# EAGLE schematic A20-OLINUXINO-MICRO_Rev_J1 (EAGLE 4.16), part 1 of 2
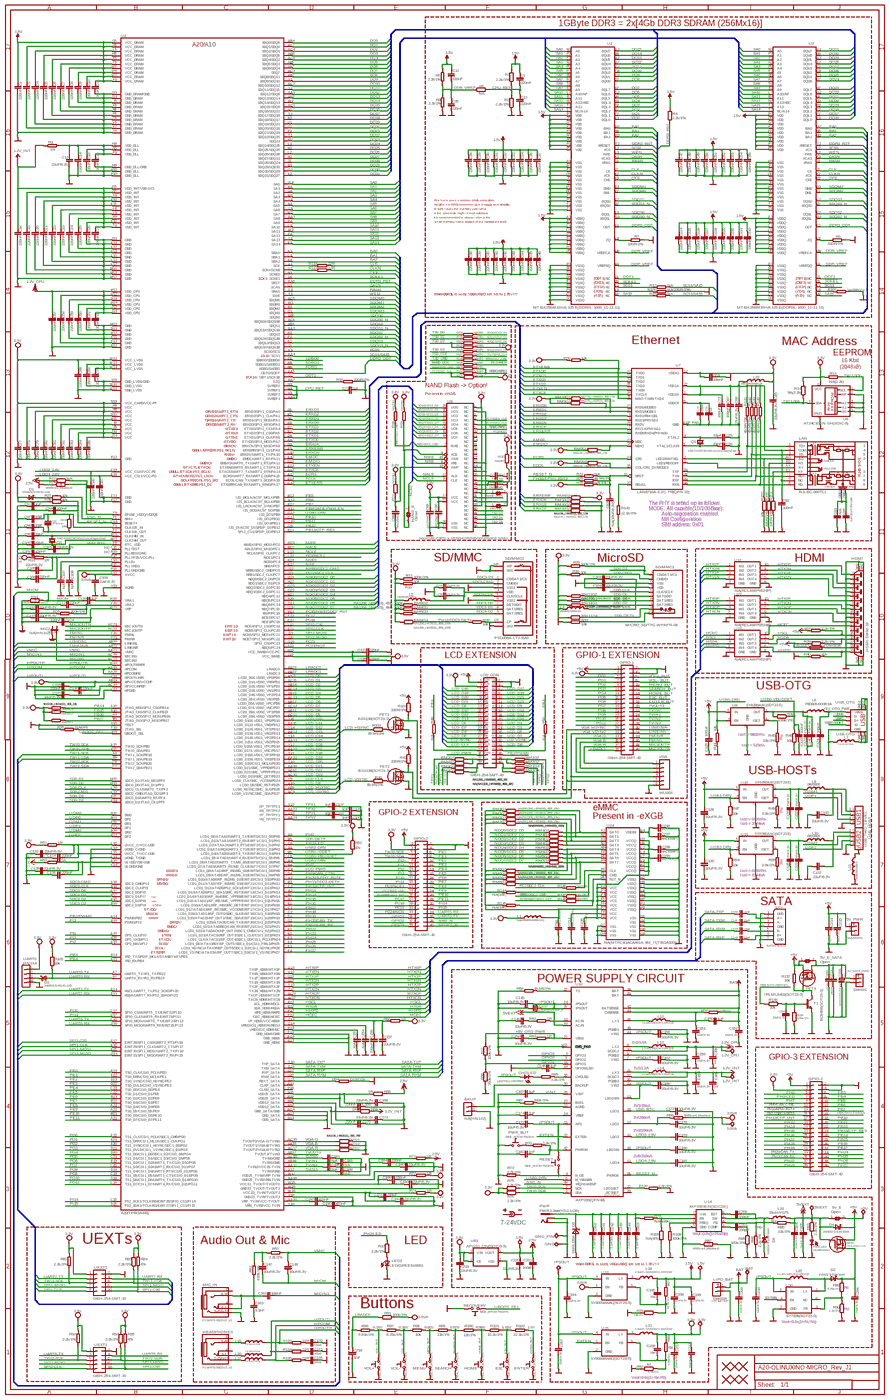
[diagram p0: schematic, sheet 1, overview]
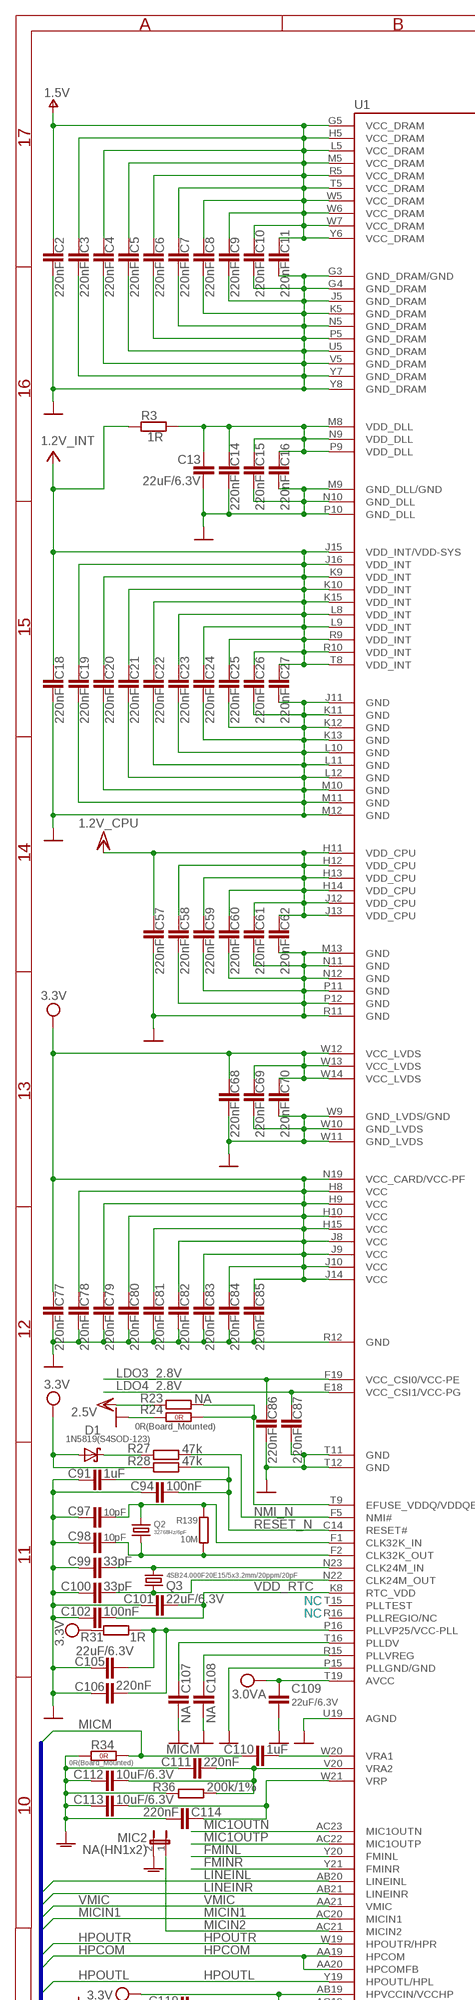
[diagram p1: schematic, sheet 1, part 1 of 4]
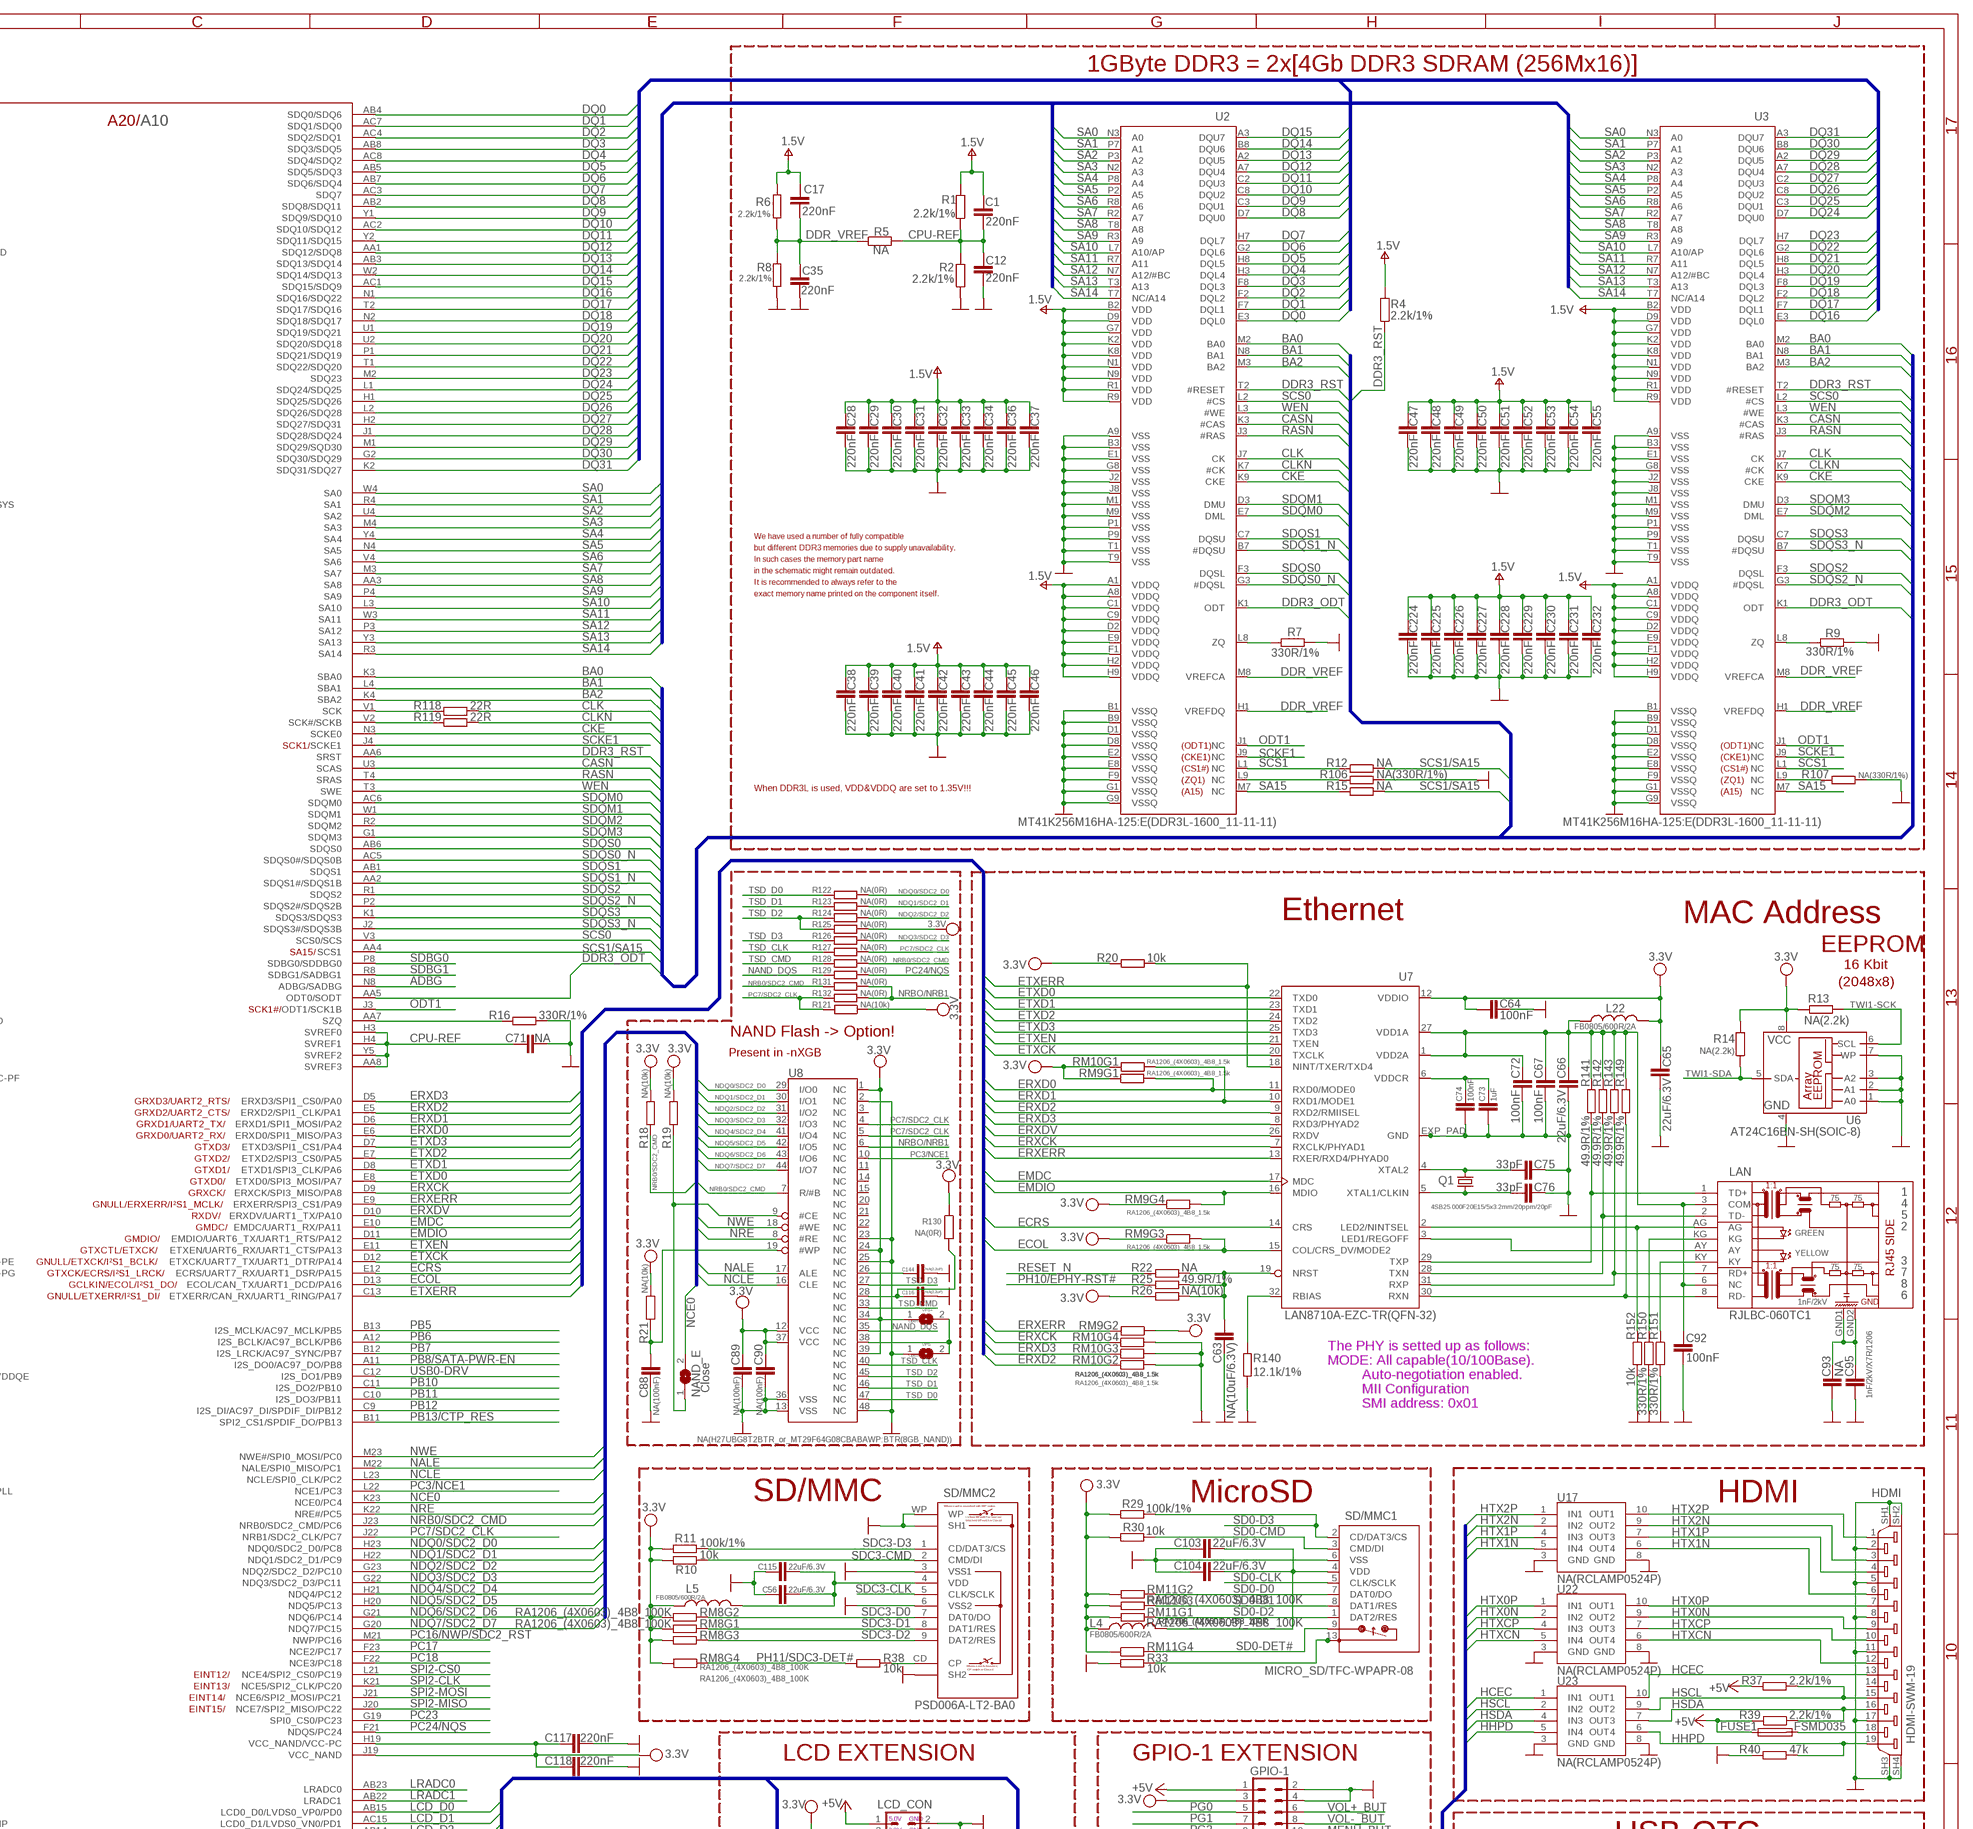
[diagram p2: schematic, sheet 1, part 2 of 4]
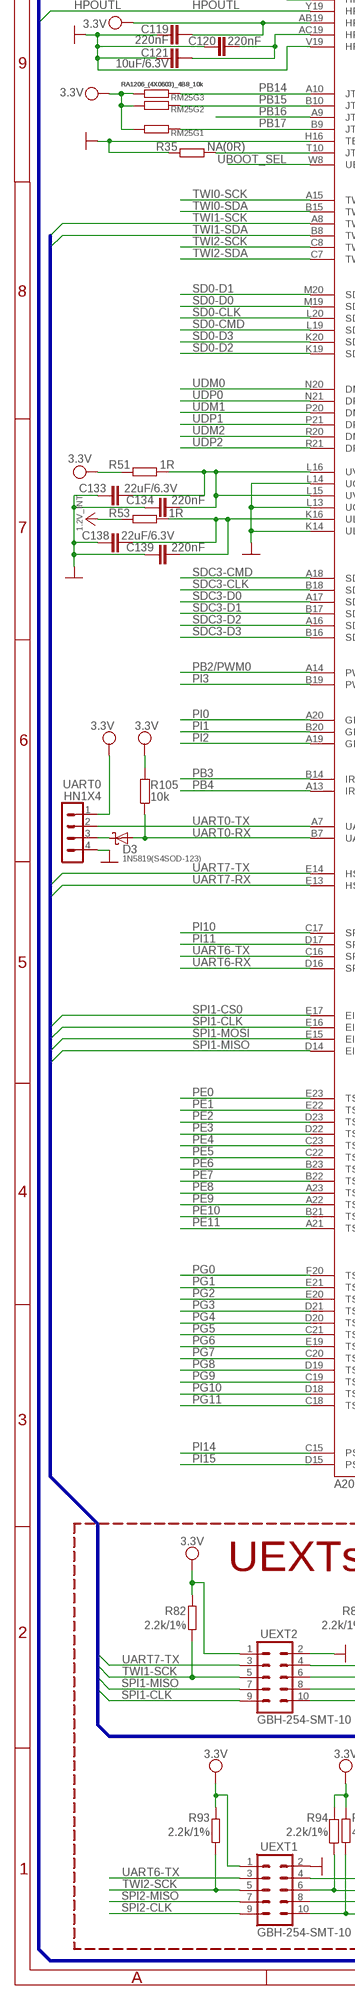
[diagram p3: schematic, sheet 1, part 3 of 4]
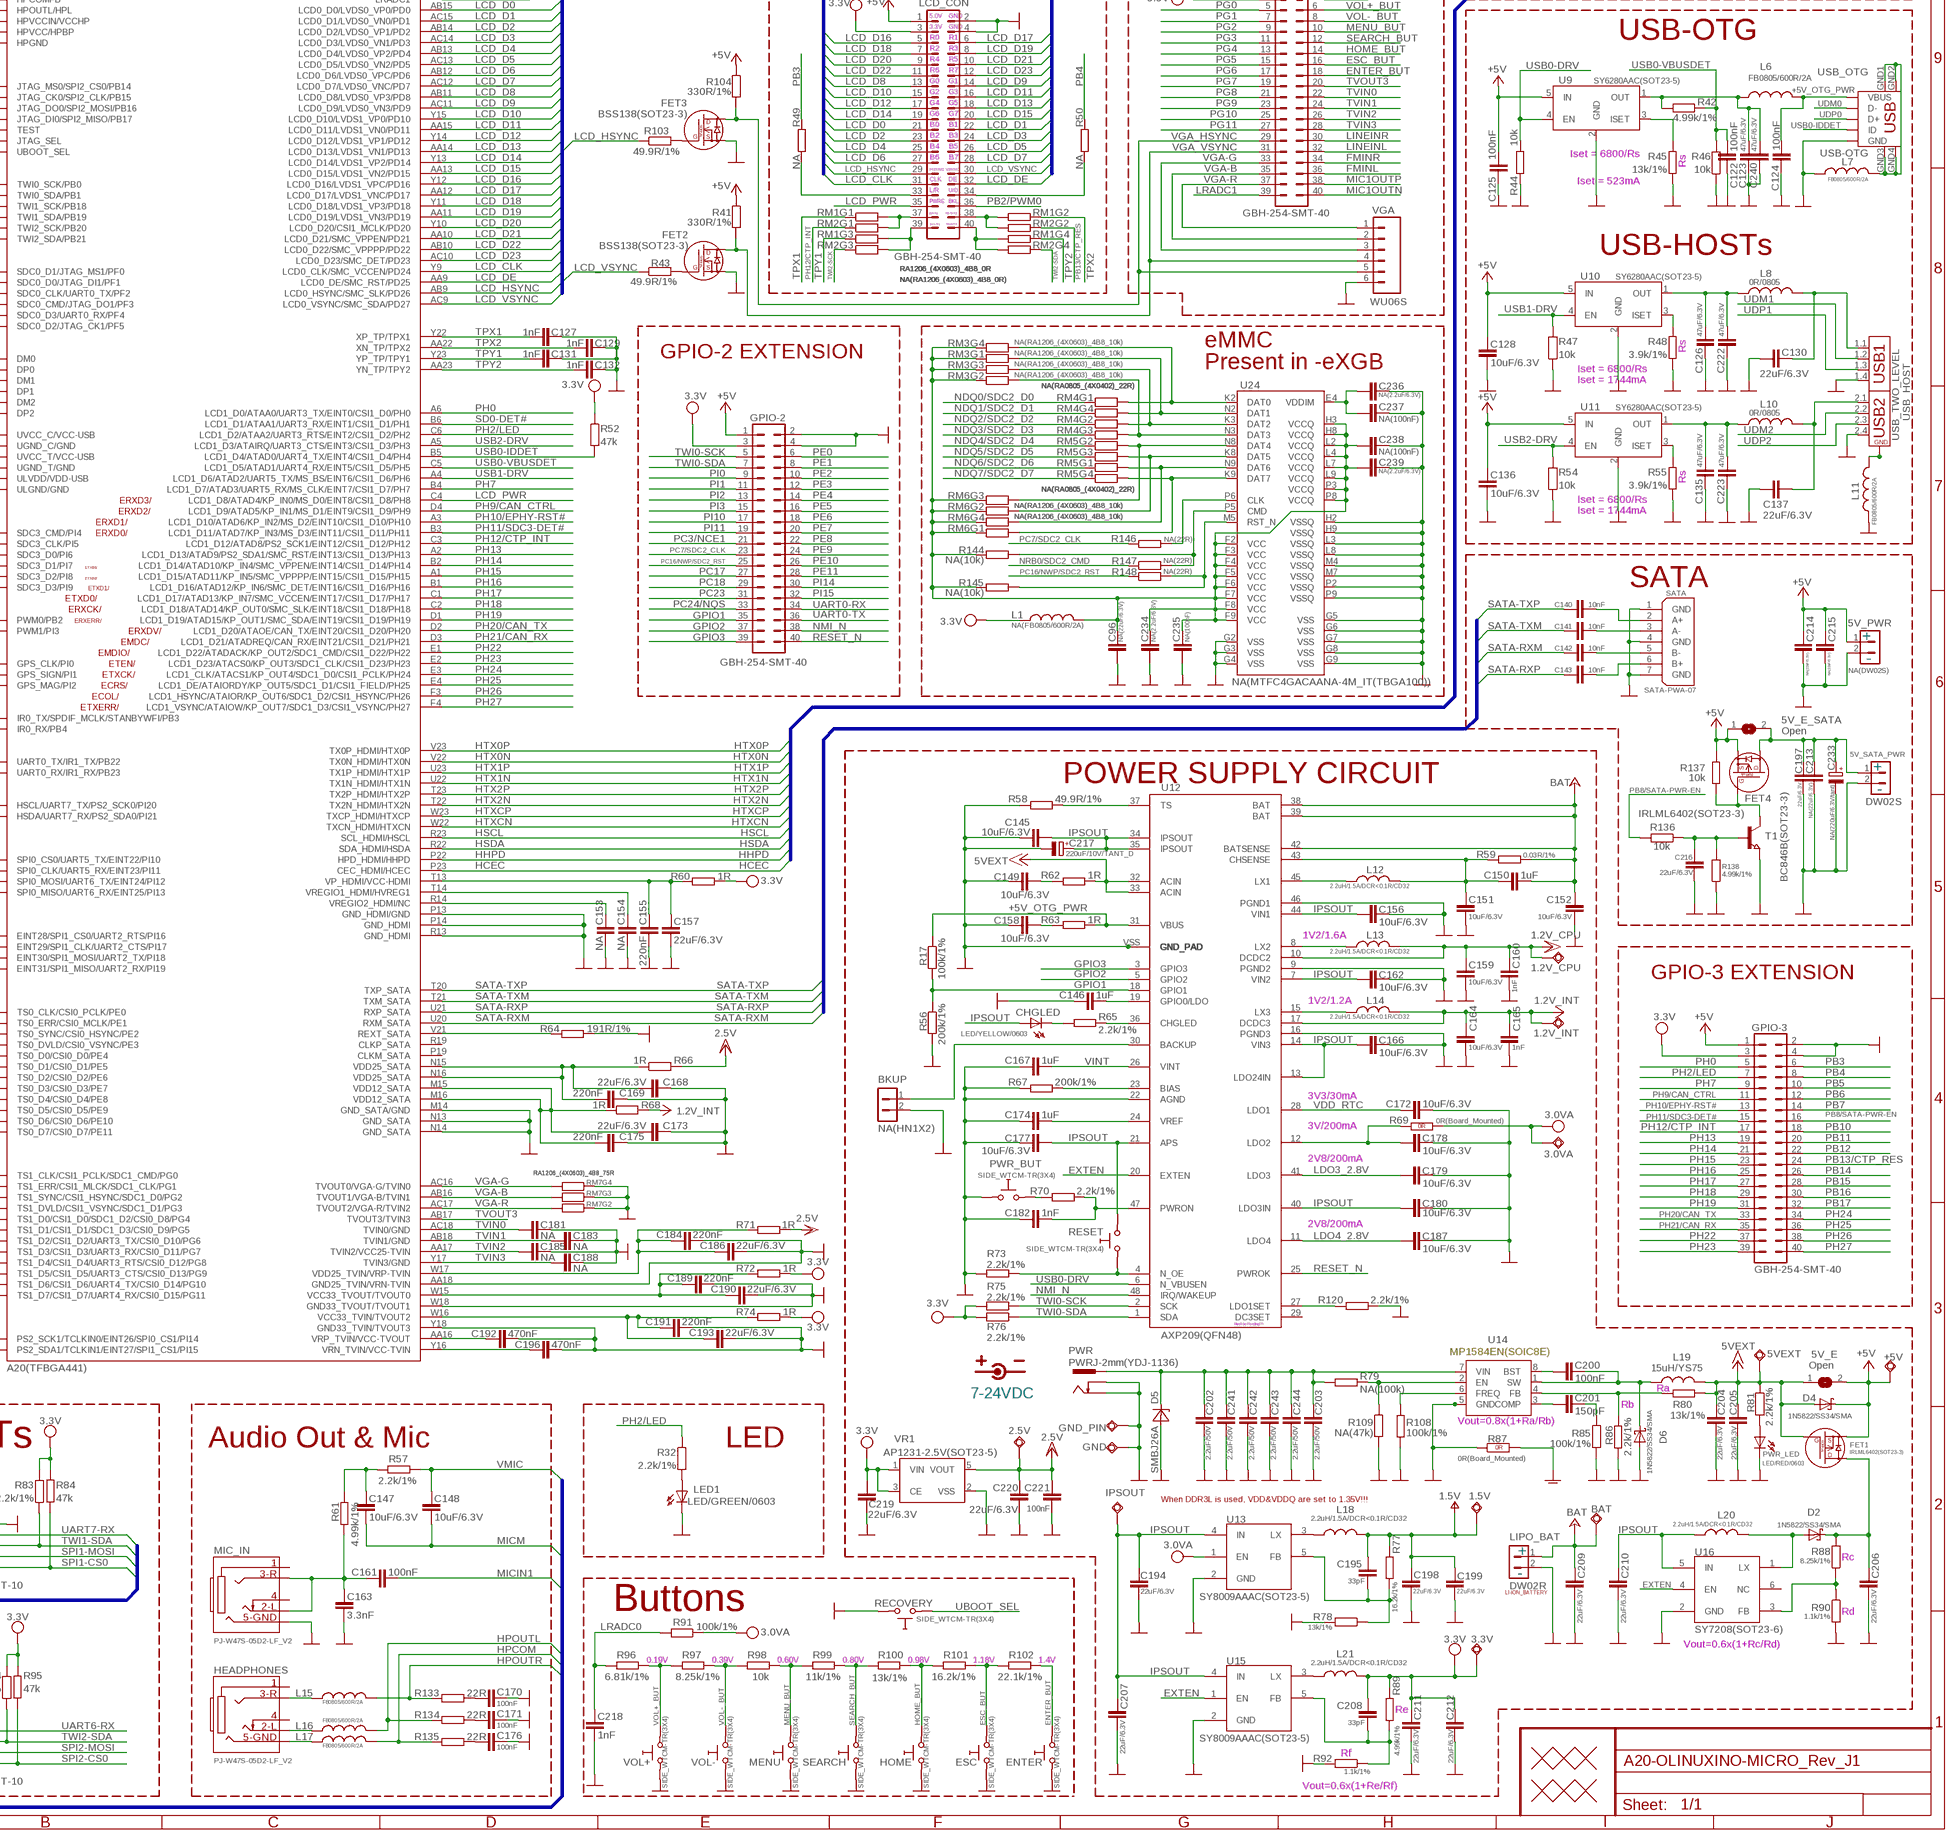
[diagram p4: schematic, sheet 1, part 4 of 4]

## Parts
1.2V_CPU  TESTPADTESTPAD_40-ROUND  [TESTPAD_40-ROUND]
1.2V_INT  TESTPADTESTPAD_40-ROUND  [TESTPAD_40-ROUND]
1.5V  TESTPADTESTPAD_40-ROUND  [TESTPAD_40-ROUND]
2.5V  TESTPADTESTPAD_40-ROUND  [TESTPAD_40-ROUND]
3.0VA  TESTPADTESTPAD_40-ROUND  [TESTPAD_40-ROUND]
3.3V  TESTPADTESTPAD_40-ROUND  [TESTPAD_40-ROUND]
5V_E  Open  SJSJ_SMALLER  [SJ_1_SMALLER]
5V_E_SATA  Open  SJSJ_SMALLER  [SJ_1_SMALLER]
5V_PWR  NA(DW02S)  CON2DW02S  [DW02S]
5V_SATA_PWR  DW02S  CON2DW02S  [DW02S]
5VEXT  TESTPADTESTPAD_40-ROUND  [TESTPAD_40-ROUND]
+5V  TESTPADTESTPAD_40-ROUND  [TESTPAD_40-ROUND]
BAT  TESTPADTESTPAD_40-ROUND  [TESTPAD_40-ROUND]
BKUP  NA(HN1X2)  CON2HN1X2  [HN1X2]
C1  220nF  C-EUC0603_DWS  [C0603_DWS]
C2  220nF  C-EUC0402_TI  [C0402_TI]
C3  220nF  C-EUC0402_TI  [C0402_TI]
C4  220nF  C-EUC0603_DWS  [C0603_DWS]
C5  220nF  C-EUC0402_TI  [C0402_TI]
C6  220nF  C-EUC0603_DWS  [C0603_DWS]
C7  220nF  C-EUC0402_TI  [C0402_TI]
C8  220nF  C-EUC0603_DWS  [C0603_DWS]
C9  220nF  C-EUC0603_DWS  [C0603_DWS]
C10  220nF  C-EUC0402_TI  [C0402_TI]
C11  220nF  C-EUC0402_TI  [C0402_TI]
C12  220nF  C-EUC0603_DWS  [C0603_DWS]
C13  22uF/6.3V  C-EUC0603_DWS  [C0603_DWS]
C14  220nF  C-EUC0402_TI  [C0402_TI]
C15  220nF  C-EUC0402_TI  [C0402_TI]
C16  220nF  C-EUC0603_DWS  [C0603_DWS]
C17  220nF  C-EUC0603_DWS  [C0603_DWS]
C18  220nF  C-EUC0402_TI  [C0402_TI]
C19  220nF  C-EUC0402_TI  [C0402_TI]
C20  220nF  C-EUC0603_DWS  [C0603_DWS]
C21  220nF  C-EUC0402_TI  [C0402_TI]
C22  220nF  C-EUC0402_TI  [C0402_TI]
C23  220nF  C-EUC0402_TI  [C0402_TI]
C24  220nF  C-EUC0402_TI  [C0402_TI]
C25  220nF  C-EUC0402_TI  [C0402_TI]
C26  220nF  C-EUC0402_TI  [C0402_TI]
C27  220nF  C-EUC0402_TI  [C0402_TI]
C28  220nF  C-EUC0603_DWS  [C0603_DWS]
C29  220nF  C-EUC0603_DWS  [C0603_DWS]
C30  220nF  C-EUC0603_DWS  [C0603_DWS]
C31  220nF  C-EUC0603_DWS  [C0603_DWS]
C32  220nF  C-EUC0603_DWS  [C0603_DWS]
C33  220nF  C-EUC0603_DWS  [C0603_DWS]
C34  220nF  C-EUC0603_DWS  [C0603_DWS]
C35  220nF  C-EUC0603_DWS  [C0603_DWS]
C36  220nF  C-EUC0603_DWS  [C0603_DWS]
C37  220nF  C-EUC0603_DWS  [C0603_DWS]
C38  220nF  C-EUC0603_DWS  [C0603_DWS]
C39  220nF  C-EUC0603_DWS  [C0603_DWS]
C40  220nF  C-EUC0603_DWS  [C0603_DWS]
C41  220nF  C-EUC0603_DWS  [C0603_DWS]
C42  220nF  C-EUC0603_DWS  [C0603_DWS]
C43  220nF  C-EUC0603_DWS  [C0603_DWS]
C44  220nF  C-EUC0603_DWS  [C0603_DWS]
C45  220nF  C-EUC0603_DWS  [C0603_DWS]
C46  220nF  C-EUC0603_DWS  [C0603_DWS]
C47  220nF  C-EUC0603_DWS  [C0603_DWS]
C48  220nF  C-EUC0603_DWS  [C0603_DWS]
C49  220nF  C-EUC0603_DWS  [C0603_DWS]
C50  220nF  C-EUC0603_DWS  [C0603_DWS]
C51  220nF  C-EUC0603_DWS  [C0603_DWS]
C52  220nF  C-EUC0603_DWS  [C0603_DWS]
C53  220nF  C-EUC0603_DWS  [C0603_DWS]
C54  220nF  C-EUC0603_DWS  [C0603_DWS]
C55  220nF  C-EUC0603_DWS  [C0603_DWS]
C56  22uF/6.3V  C-EUC0603_DWS  [C0603_DWS]
C57  220nF  C-EUC0402_TI  [C0402_TI]
C58  220nF  C-EUC0603_DWS  [C0603_DWS]
C59  220nF  C-EUC0402_TI  [C0402_TI]
C60  220nF  C-EUC0402_TI  [C0402_TI]
C61  220nF  C-EUC0402_TI  [C0402_TI]
C62  220nF  C-EUC0402_TI  [C0402_TI]
C63  NA(10uF/6.3V)  C-EUC0603_DWS  [C0603_DWS]
C64  100nF  C-EUC0603_DWS  [C0603_DWS]
C65  22uF/6.3V  C-EUC0603_DWS  [C0603_DWS]
C66  22uF/6.3V  C-EUC0603_DWS  [C0603_DWS]
C67  100nF  C-EUC0603_DWS  [C0603_DWS]
C68  220nF  C-EUC0402_TI  [C0402_TI]
C69  220nF  C-EUC0402_TI  [C0402_TI]
C70  220nF  C-EUC0402_TI  [C0402_TI]
C71  NA  C-EUC0603_DWS  [C0603_DWS]
C72  100nF  C-EUC0603_DWS  [C0603_DWS]
C73  1uF  C-EUC0603_DWS  [C0603_DWS]
C74  100nF  C-EUC0603_DWS  [C0603_DWS]
C75  33pF  C-EUC0603_DWS  [C0603_DWS]
C76  33pF  C-EUC0603_DWS  [C0603_DWS]
C77  220nF  C-EUC0402_TI  [C0402_TI]
C78  220nF  C-EUC0402_TI  [C0402_TI]
C79  220nF  C-EUC0402_TI  [C0402_TI]
C80  220nF  C-EUC0402_TI  [C0402_TI]
C81  220nF  C-EUC0603_DWS  [C0603_DWS]
C82  220nF  C-EUC0402_TI  [C0402_TI]
C83  220nF  C-EUC0402_TI  [C0402_TI]
C84  220nF  C-EUC0402_TI  [C0402_TI]
C85  220nF  C-EUC0402_TI  [C0402_TI]
C86  220nF  C-EUC0402_TI  [C0402_TI]
C87  220nF  C-EUC0402_TI  [C0402_TI]
C88  NA(100nF)  C-EUC0603_DWS  [C0603_DWS]
C89  NA(100nF)  C-EUC0603_DWS  [C0603_DWS]
C90  NA(100nF)  C-EUC0603_DWS  [C0603_DWS]
C91  1uF  C-EUC0603_DWS  [C0603_DWS]
C92  100nF  C-EUC0603_DWS  [C0603_DWS]
C93  NA  C-EUC1206_5MILS_WS_ISO  [C1206_5MILS_WS_ISO]
C94  100nF  C-EUC0603_DWS  [C0603_DWS]
C95  1nF/2kV/X7R/1206  C-EUC1206_5MILS_WS_ISO  [C1206_5MILS_WS_ISO]
C96  NA(22uF/6.3V)  C-EUC0603_DWS  [C0603_DWS]
C97  10pF  C-EUC0603_DWS  [C0603_DWS]
C98  10pF  C-EUC0603_DWS  [C0603_DWS]
C99  33pF  C-EUC0603_DWS  [C0603_DWS]
C100  33pF  C-EUC0603_DWS  [C0603_DWS]
C101  22uF/6.3V  C-EUC0603_DWS  [C0603_DWS]
C102  100nF  C-EUC0402_TI  [C0402_TI]
C103  22uF/6.3V  C-EUC0603_DWS  [C0603_DWS]
C104  22uF/6.3V  C-EUC0603_DWS  [C0603_DWS]
C105  22uF/6.3V  C-EUC0603_DWS  [C0603_DWS]
C106  220nF  C-EUC0402_TI  [C0402_TI]
C107  NA  C-EUC0402_TI  [C0402_TI]
C108  NA  C-EUC0402_TI  [C0402_TI]
C109  22uF/6.3V  C-EUC0603_DWS  [C0603_DWS]
C110  1uF  C-EUC0603_DWS  [C0603_DWS]
C111  220nF  C-EUC0603_DWS  [C0603_DWS]
C112  10uF/6.3V  C-EUC0603_DWS  [C0603_DWS]
C113  10uF/6.3V  C-EUC0603_DWS  [C0603_DWS]
C114  220nF  C-EUC0603_DWS  [C0603_DWS]
C115  22uF/6.3V  C-EUC0603_DWS  [C0603_DWS]
C116  NA(2.2uF)  C-EUC0603_DWS  [C0603_DWS]
C117  220nF  C-EUC0603_DWS  [C0603_DWS]
C118  220nF  C-EUC0603_DWS  [C0603_DWS]
C119  220nF  C-EUC0603_DWS  [C0603_DWS]
C120  220nF  C-EUC0603_DWS  [C0603_DWS]
C121  10uF/6.3V  C-EUC0603_DWS  [C0603_DWS]
C122  100nF  C-EUC0603_DWS  [C0603_DWS]
C123  47uF/6.3V  C-EUC0805_5MIL_DWS  [C0805_5MIL_DWS]
C124  100nF  C-EUC0603_DWS  [C0603_DWS]
C125  100nF  C-EUC0603_DWS  [C0603_DWS]
C126  47uF/6.3V  C-EUC0805_5MIL_DWS  [C0805_5MIL_DWS]
C127  1nF  C-EUC0603_DWS  [C0603_DWS]
C128  10uF/6.3V  C-EUC0603_DWS  [C0603_DWS]
C129  1nF  C-EUC0603_DWS  [C0603_DWS]
C130  22uF/6.3V  C-EUC0603_DWS  [C0603_DWS]
C131  1nF  C-EUC0603_DWS  [C0603_DWS]
C132  1nF  C-EUC0603_DWS  [C0603_DWS]
C133  22uF/6.3V  C-EUC0603_DWS  [C0603_DWS]
C134  220nF  C-EUC0402_TI  [C0402_TI]
C135  47uF/6.3V  C-EUC0805_5MIL_DWS  [C0805_5MIL_DWS]
C136  10uF/6.3V  C-EUC0603_DWS  [C0603_DWS]
C137  22uF/6.3V  C-EUC0603_DWS  [C0603_DWS]
C138  22uF/6.3V  C-EUC0603_DWS  [C0603_DWS]
C139  220nF  C-EUC0402_TI  [C0402_TI]
C140  10nF  C-EUC0402_TI  [C0402_TI]
C141  10nF  C-EUC0402_TI  [C0402_TI]
C142  10nF  C-EUC0402_TI  [C0402_TI]
C143  10nF  C-EUC0402_TI  [C0402_TI]
C144  NA(2.2uF)  C-EUC0603_DWS  [C0603_DWS]
C145  10uF/6.3V  C-EUC0603_DWS  [C0603_DWS]
C146  1uF  C-EUC0603_DWS  [C0603_DWS]
C147  10uF/6.3V  C-EUC0603_DWS  [C0603_DWS]
C148  10uF/6.3V  C-EUC0603_DWS  [C0603_DWS]
C149  10uF/6.3V  C-EUC0603_DWS  [C0603_DWS]
C150  1uF  C-EUC0603_DWS  [C0603_DWS]
C151  10uF/6.3V  C-EUC0603_DWS  [C0603_DWS]
C152  10uF/6.3V  C-EUC0603_DWS  [C0603_DWS]
C153  NA  C-EUC0402_TI  [C0402_TI]
C154  NA  C-EUC0402_TI  [C0402_TI]
C155  220nF  C-EUC0402_TI  [C0402_TI]
C156  10uF/6.3V  C-EUC0603_DWS  [C0603_DWS]
C157  22uF/6.3V  C-EUC0603_DWS  [C0603_DWS]
C158  10uF/6.3V  C-EUC0603_DWS  [C0603_DWS]
C159  10uF/6.3V  C-EUC0603_DWS  [C0603_DWS]
C160  1nF  C-EUC0603_DWS  [C0603_DWS]
C161  100nF  C-EUC0603_DWS  [C0603_DWS]
C162  10uF/6.3V  C-EUC0603_DWS  [C0603_DWS]
C163  3.3nF  C-EUC0603_DWS  [C0603_DWS]
C164  10uF/6.3V  C-EUC0603_DWS  [C0603_DWS]
C165  1nF  C-EUC0603_DWS  [C0603_DWS]
C166  10uF/6.3V  C-EUC0603_DWS  [C0603_DWS]
C167  1uF  C-EUC0603_DWS  [C0603_DWS]
C168  22uF/6.3V  C-EUC0603_DWS  [C0603_DWS]
C169  220nF  C-EUC0402_TI  [C0402_TI]
C170  100nF  C-EUC0603_DWS  [C0603_DWS]
C171  100nF  C-EUC0603_DWS  [C0603_DWS]
C172  10uF/6.3V  C-EUC0603_DWS  [C0603_DWS]
C173  22uF/6.3V  C-EUC0603_DWS  [C0603_DWS]
C174  1uF  C-EUC0603_DWS  [C0603_DWS]
C175  220nF  C-EUC0402_TI  [C0402_TI]
C176  100nF  C-EUC0603_DWS  [C0603_DWS]
C177  10uF/6.3V  C-EUC0603_DWS  [C0603_DWS]
C178  10uF/6.3V  C-EUC0603_DWS  [C0603_DWS]
C179  10uF/6.3V  C-EUC0603_DWS  [C0603_DWS]
C180  10uF/6.3V  C-EUC0603_DWS  [C0603_DWS]
C181  NA  C-EUC0603_DWS  [C0603_DWS]
C182  1nF  C-EUC0603_DWS  [C0603_DWS]
C183  NA  C-EUC0603_DWS  [C0603_DWS]
C184  220nF  C-EUC0402_TI  [C0402_TI]
C185  NA  C-EUC0603_DWS  [C0603_DWS]
C186  22uF/6.3V  C-EUC0603_DWS  [C0603_DWS]
C187  10uF/6.3V  C-EUC0603_DWS  [C0603_DWS]
C188  NA  C-EUC0603_DWS  [C0603_DWS]
C189  220nF  C-EUC0402_TI  [C0402_TI]
C190  22uF/6.3V  C-EUC0603_DWS  [C0603_DWS]
C191  220nF  C-EUC0402_TI  [C0402_TI]
C192  470nF  C-EUC0603_DWS  [C0603_DWS]
C193  22uF/6.3V  C-EUC0603_DWS  [C0603_DWS]
C194  22uF/6.3V  C-EUC0603_DWS  [C0603_DWS]
C195  33pF  C-EUC0603_DWS  [C0603_DWS]
C196  470nF  C-EUC0603_DWS  [C0603_DWS]
C197  22uF/6.3V  C-EUC0603_DWS  [C0603_DWS]
C198  22uF/6.3V  C-EUC0603_DWS  [C0603_DWS]
C199  22uF/6.3V  C-EUC0603_DWS  [C0603_DWS]
C200  100nF  C-EUC0402_TI  [C0402_TI]
C201  150pF  C-EUC0603_DWS  [C0603_DWS]
C202  2.2uF/50V  C-EUC0805_5MIL_DWS  [C0805_5MIL_DWS]
C203  2.2uF/50V  C-EUC0805_5MIL_DWS  [C0805_5MIL_DWS]
C204  22uF/6.3V  C-EUC0603_DWS  [C0603_DWS]
C205  22uF/6.3V  C-EUC0603_DWS  [C0603_DWS]
C206  22uF/6.3V  C-EUC0603_DWS  [C0603_DWS]
C207  22uF/6.3V  C-EUC0603_DWS  [C0603_DWS]
C208  33pF  C-EUC0603_DWS  [C0603_DWS]
C209  22uF/6.3V  C-EUC0603_DWS  [C0603_DWS]
C210  22uF/6.3V  C-EUC0603_DWS  [C0603_DWS]
C211  22uF/6.3V  C-EUC0603_DWS  [C0603_DWS]
C212  22uF/6.3V  C-EUC0603_DWS  [C0603_DWS]
C213  NA(22uF/6.3V)  C-EUC0603_DWS  [C0603_DWS]
C214  NA(22uF/6.3V)  C-EUC0603_DWS  [C0603_DWS]
C215  NA(22uF/6.3V)  C-EUC0603_DWS  [C0603_DWS]
C216  22uF/6.3V  C-EUC0603_DWS  [C0603_DWS]
C217  220uF/10V/TANT_D  CPOL-EUCT7343  [CT7343]
C218  1nF  C-EUC0603_DWS  [C0603_DWS]
C219  22uF/6.3V  C-EUC0603_DWS  [C0603_DWS]
C220  22uF/6.3V  C-EUC0603_DWS  [C0603_DWS]
C221  100nF  C-EUC0603_DWS  [C0603_DWS]
C222  47uF/6.3V  C-EUC0805_5MIL_DWS  [C0805_5MIL_DWS]
C223  47uF/6.3V  C-EUC0805_5MIL_DWS  [C0805_5MIL_DWS]
C224  220nF  C-EUC0603_DWS  [C0603_DWS]
C225  220nF  C-EUC0603_DWS  [C0603_DWS]
C226  220nF  C-EUC0603_DWS  [C0603_DWS]
C227  220nF  C-EUC0603_DWS  [C0603_DWS]
C228  220nF  C-EUC0603_DWS  [C0603_DWS]
C229  220nF  C-EUC0603_DWS  [C0603_DWS]
C230  220nF  C-EUC0603_DWS  [C0603_DWS]
C231  220nF  C-EUC0603_DWS  [C0603_DWS]
C232  220nF  C-EUC0603_DWS  [C0603_DWS]
C233  NA(220uF/6.3V/tant)  CPOL-EUCT6032  [CT6032]
C234  NA(2.2uF/6.3V)  C-EUC0603_DWS  [C0603_DWS]
C235  NA(100nF)  C-EUC0402_TI  [C0402_TI]
C236  NA(2.2uF/6.3V)  C-EUC0603_DWS  [C0603_DWS]
C237  NA(100nF)  C-EUC0402_TI  [C0402_TI]
C238  NA(100nF)  C-EUC0402_TI  [C0402_TI]
C239  NA(2.2uF/6.3V)  C-EUC0603_DWS  [C0603_DWS]
C240  47uF/6.3V  C-EUC0805_5MIL_DWS  [C0805_5MIL_DWS]
C241  2.2uF/50V  C-EUC0805_5MIL_DWS  [C0805_5MIL_DWS]
C242  2.2uF/50V  C-EUC0805_5MIL_DWS  [C0805_5MIL_DWS]
C243  2.2uF/50V  C-EUC0805_5MIL_DWS  [C0805_5MIL_DWS]
C244  2.2uF/50V  C-EUC0805_5MIL_DWS  [C0805_5MIL_DWS]
CHGLED  LED/YELLOW/0603  LED0603DWS  [LED-0603]
D1  1N5819(S4SOD-123)  SCHOTKKY7.62SS-1N5819(S4SOD-123)  [SOD-123]
D2  1N5822/SS34/SMA  SCHOTKKY7.62SS2  [MLL-41]
D3  1N5819(S4SOD-123)  SCHOTKKY7.62SS-1N5819(S4SOD-123)  [SOD-123]
D4  1N5822/SS34/SMA  SCHOTKKY7.62SS2  [MLL-41]
D5  SMBJ26A  SMBJ16A  [DO214AA]
D6  1N5822/SS34/SMA  SCHOTKKY7.62SS2  [MLL-41]
ENTER  SIDE_WTCM-TR(3X4)  SW-TAKTSIDE_WTCM-TR(3X4)  [SW_TAKT3X4]
ESC  SIDE_WTCM-TR(3X4)  SW-TAKTSIDE_WTCM-TR(3X4)  [SW_TAKT3X4]
FET1  IRLML6402(SOT23-3)  P-MOS+DIODIRLML6402  [SOT23]
FET2  BSS138(SOT23-3)  N-MOS+DIODBSS138(SOT23-3)  [SOT23]
FET3  BSS138(SOT23-3)  N-MOS+DIODBSS138(SOT23-3)  [SOT23]
FET4  IRLML6402(SOT23-3)  P-MOS+DIODIRLML6402  [SOT23]
FUSE1  FSMD035  FUSE  [1206]
GND  TESTPADTESTPAD_40-ROUND  [TESTPAD_40-ROUND]
GND_PIN  TESTPAD3  [TEST_PAD40/70/SQUARE]
GPIO-1  GBH-254-SMT-40  ML40-GBH-254-SMT-40  [ML40-MALE(GBH-254-SMT-40)]
GPIO-2  GBH-254-SMT-40  ML40-GBH-254-SMT-40  [ML40-MALE(GBH-254-SMT-40)]
GPIO-3  GBH-254-SMT-40  ML40-GBH-254-SMT-40  [ML40-MALE(GBH-254-SMT-40)]
HDMI  HDMI-SWM-19  HDMI-MC34931HDMI-SWM-19  [HDMI-SWM-19]
HEADPHONES  PJ-W47S-05D2-LF_V2  AUDIO_JACK_5PINPJ-W47S-05D2-LF_V2  [PJ-W47S-05D2-LF_5PIN_V2]
HOME  SIDE_WTCM-TR(3X4)  SW-TAKTSIDE_WTCM-TR(3X4)  [SW_TAKT3X4]
IPSOUT  TESTPADTESTPAD_40-ROUND  [TESTPAD_40-ROUND]
L1  NA(FB0805/600R/2A)  L-USL0805_5MIL_DWS  [L0805_5MIL_DWS]
L4  FB0805/600R/2A  L-USL0805_5MIL_DWS  [L0805_5MIL_DWS]
L5  FB0805/600R/2A  L-USL0805_5MIL_DWS  [L0805_5MIL_DWS]
L6  FB0805/600R/2A  L-USL0805_5MIL_DWS  [L0805_5MIL_DWS]
L7  FB0805/600R/2A  L-USL0805_5MIL_DWS  [L0805_5MIL_DWS]
L8  0R/0805  L-USL0805_5MIL_DWS  [L0805_5MIL_DWS]
L10  0R/0805  L-USL0805_5MIL_DWS  [L0805_5MIL_DWS]
L11  FB0805/600R/2A  L-USL0805_5MIL_DWS  [L0805_5MIL_DWS]
L12  2.2uH/1.5A/DCR<0.1R/CD32  L-CD32  [CD32]
L13  2.2uH/1.5A/DCR<0.1R/CD32  L-CD32  [CD32]
L14  2.2uH/1.5A/DCR<0.1R/CD32  L-CD32  [CD32]
L15  FB0805/600R/2A  L-USL0805_5MIL_DWS  [L0805_5MIL_DWS]
L16  FB0805/600R/2A  L-USL0805_5MIL_DWS  [L0805_5MIL_DWS]
L17  FB0805/600R/2A  L-USL0805_5MIL_DWS  [L0805_5MIL_DWS]
L18  2.2uH/1.5A/DCR<0.1R/CD32  L-CD32  [CD32]
L19  15uH/YS75  LLQH88PN100M38  [8X8MM_3131]
L20  2.2uH/1.5A/DCR<0.1R/CD32  L-CD32  [CD32]
L21  2.2uH/1.5A/DCR<0.1R/CD32  L-CD32  [CD32]
L22  FB0805/600R/2A  L-USL0805_5MIL_DWS  [L0805_5MIL_DWS]
LAN  RJLBC-060TC1  RJLBC-060TC1_GND_MILLING  [RJLBC-060TC1_MILLING]
LCD_CON  GBH-254-SMT-40  ML40-GBH-254-SMT-40  [ML40-MALE(GBH-254-SMT-40)]
LED1  LED/GREEN/0603  LED0603DWS  [LED-0603]
LIPO_BAT  DW02R  CON2DW02R  [DW02R]
MENU  SIDE_WTCM-TR(3X4)  SW-TAKTSIDE_WTCM-TR(3X4)  [SW_TAKT3X4]
MIC2  NA(HN1x2)  JP1E  [JP1]
MIC_IN  PJ-W47S-05D2-LF_V2  AUDIO_JACK_5PINPJ-W47S-05D2-LF_V2  [PJ-W47S-05D2-LF_5PIN_V2]
NAND_E  Close  SJSJ_1_SMALLER_CLOSE_10MILS  [SJ_1_SMALLER_CLOSE_10MILS]
PWR  PWRJ-2mm(YDJ-1136)  PWR-JAKPWR_JACK_UNI_MILLING_SMALLER_DRILLS  [PWR_JACK_UNI_MILLING_SMALLER_DRILLS]
PWR_BUT  SIDE_WTCM-TR(3X4)  SW-TAKTSIDE_WTCM-TR(3X4)  [SW_TAKT3X4]
PWR_LED  LED/RED/0603  LED0603DWS  [LED-0603]
Q1  4SB25.000F20E15/5x3.2mm/20ppm/20pF  HC49/S_E4SB25.000F20E15  [HCX-4S]
Q2  32768Hz/6pF  MC-306_32.768KHZ/SMD_8038  [MC-306]
Q3  4SB24.000F20E15/5x3.2mm/20ppm/20pF  HC49/S_E4SB25.000F20E15  [HCX-4S]
R1  2.2k/1%  R-EU_R0603_5MIL_DWS  [R0603_5MIL_DWS]
R2  2.2k/1%  R-EU_R0603_5MIL_DWS  [R0603_5MIL_DWS]
R3  1R  R-EU_R0603_5MIL_DWS  [R0603_5MIL_DWS]
R4  2.2k/1%  R-EU_R0603_5MIL_DWS  [R0603_5MIL_DWS]
R5  NA  R-EU_R0603_5MIL_DWS  [R0603_5MIL_DWS]
R6  2.2k/1%  R-EU_R0603_5MIL_DWS  [R0603_5MIL_DWS]
R7  330R/1%  R-EU_R0603_5MIL_DWS  [R0603_5MIL_DWS]
R8  2.2k/1%  R-EU_R0603_5MIL_DWS  [R0603_5MIL_DWS]
R9  330R/1%  R-EU_R0603_5MIL_DWS  [R0603_5MIL_DWS]
R10  10k  R-EU_R0603_5MIL_DWS  [R0603_5MIL_DWS]
R11  100k/1%  R-EU_R0603_5MIL_DWS  [R0603_5MIL_DWS]
R12  NA  R-EU_R0402_SMALL  [R0402_SMALL]
R13  NA(2.2k)  R-EU_R0603_5MIL_DWS  [R0603_5MIL_DWS]
R14  NA(2.2k)  R-EU_R0603_5MIL_DWS  [R0603_5MIL_DWS]
R15  NA  R-EU_R0402_SMALL  [R0402_SMALL]
R16  330R/1%  R-EU_R0603_5MIL_DWS  [R0603_5MIL_DWS]
R17  100k/1%  R-EU_R0603_5MIL_DWS  [R0603_5MIL_DWS]
R18  NA(10k)  R-EU_R0603_5MIL_DWS  [R0603_5MIL_DWS]
R19  NA(10k)  R-EU_R0603_5MIL_DWS  [R0603_5MIL_DWS]
R20  10k  R-EU_R0603_5MIL_DWS  [R0603_5MIL_DWS]
R21  NA(10k)  R-EU_R0603_5MIL_DWS  [R0603_5MIL_DWS]
R22  NA  R-EU_R0603_5MIL_DWS  [R0603_5MIL_DWS]
R23  NA  R-EU_R0603_5MIL_DWS  [R0603_5MIL_DWS]
R24  0R(Board_Mounted)  R_0R0R(NA)  [0603_0R]
R25  49.9R/1%  R-EU_R0603_5MIL_DWS  [R0603_5MIL_DWS]
R26  NA(10k)  R-EU_R0603_5MIL_DWS  [R0603_5MIL_DWS]
R27  47k  R-EU_R0603_5MIL_DWS  [R0603_5MIL_DWS]
R28  47k  R-EU_R0603_5MIL_DWS  [R0603_5MIL_DWS]
R29  100k/1%  R-EU_R0603_5MIL_DWS  [R0603_5MIL_DWS]
R30  10k  R-EU_R0603_5MIL_DWS  [R0603_5MIL_DWS]
R31  1R  R-EU_R0603_5MIL_DWS  [R0603_5MIL_DWS]
R32  2.2k/1%  R-EU_R0603_5MIL_DWS  [R0603_5MIL_DWS]
R33  10k  R-EU_R0603_5MIL_DWS  [R0603_5MIL_DWS]
R34  0R(Board_Mounted)  R_0R0R(NA)  [0603_0R]
R35  NA(0R)  R-EU_R0603_5MIL_DWS  [R0603_5MIL_DWS]
R36  200k/1%  R-EU_R0603_5MIL_DWS  [R0603_5MIL_DWS]
R37  2.2k/1%  R-EU_R0603_5MIL_DWS  [R0603_5MIL_DWS]
R38  10k  R-EU_R0603_5MIL_DWS  [R0603_5MIL_DWS]
R39  2.2k/1%  R-EU_R0603_5MIL_DWS  [R0603_5MIL_DWS]
R40  47k  R-EU_R0603_5MIL_DWS  [R0603_5MIL_DWS]
R41  330R/1%  R-EU_R0603_5MIL_DWS  [R0603_5MIL_DWS]
R42  4.99k/1%  R-EU_R0603_5MIL_DWS  [R0603_5MIL_DWS]
R43  49.9R/1%  R-EU_R0603_5MIL_DWS  [R0603_5MIL_DWS]
R44  10k  R-EU_R0603_5MIL_DWS  [R0603_5MIL_DWS]
R45  13k/1%  R-EU_R0603_5MIL_DWS  [R0603_5MIL_DWS]
R46  10k  R-EU_R0603_5MIL_DWS  [R0603_5MIL_DWS]
R47  10k  R-EU_R0603_5MIL_DWS  [R0603_5MIL_DWS]
R48  3.9k/1%  R-EU_R0603_5MIL_DWS  [R0603_5MIL_DWS]
R49  NA  R-EU_R0603_5MIL_DWS  [R0603_5MIL_DWS]
R50  NA  R-EU_R0603_5MIL_DWS  [R0603_5MIL_DWS]
R51  1R  R-EU_R0603_5MIL_DWS  [R0603_5MIL_DWS]
R52  47k  R-EU_R0603_5MIL_DWS  [R0603_5MIL_DWS]
R53  1R  R-EU_R0603_5MIL_DWS  [R0603_5MIL_DWS]
R54  10k  R-EU_R0603_5MIL_DWS  [R0603_5MIL_DWS]
R55  3.9k/1%  R-EU_R0603_5MIL_DWS  [R0603_5MIL_DWS]
R56  200k/1%  R-EU_R0603_5MIL_DWS  [R0603_5MIL_DWS]
R57  2.2k/1%  R-EU_R0603_5MIL_DWS  [R0603_5MIL_DWS]
R58  49.9R/1%  R-EU_R0603_5MIL_DWS  [R0603_5MIL_DWS]
R59  0.03R/1%  R-EU_R1206_5MIL_WS  [R1206_5MIL_WS]
R60  1R  R-EU_R0603_5MIL_DWS  [R0603_5MIL_DWS]
R61  4.99k/1%  R-EU_R0603_5MIL_DWS  [R0603_5MIL_DWS]
R62  1R  R-EU_R0603_5MIL_DWS  [R0603_5MIL_DWS]
R63  1R  R-EU_R0603_5MIL_DWS  [R0603_5MIL_DWS]
R64  191R/1%  R-EU_R0603_5MIL_DWS  [R0603_5MIL_DWS]
R65  2.2k/1%  R-EU_R0603_5MIL_DWS  [R0603_5MIL_DWS]
R66  1R  R-EU_R0603_5MIL_DWS  [R0603_5MIL_DWS]
R67  200k/1%  R-EU_R0603_5MIL_DWS  [R0603_5MIL_DWS]
R68  1R  R-EU_R0603_5MIL_DWS  [R0603_5MIL_DWS]
R69  0R(Board_Mounted)  R_0R0R(NA)  [0603_0R]
R70  2.2k/1%  R-EU_R0603_5MIL_DWS  [R0603_5MIL_DWS]
R71  1R  R-EU_R0603_5MIL_DWS  [R0603_5MIL_DWS]
R72  1R  R-EU_R0603_5MIL_DWS  [R0603_5MIL_DWS]
R73  2.2k/1%  R-EU_R0603_5MIL_DWS  [R0603_5MIL_DWS]
R74  1R  R-EU_R0603_5MIL_DWS  [R0603_5MIL_DWS]
R75  2.2k/1%  R-EU_R0603_5MIL_DWS  [R0603_5MIL_DWS]
R76  2.2k/1%  R-EU_R0603_5MIL_DWS  [R0603_5MIL_DWS]
R77  16.2k/1%  R-EU_R0603_5MIL_DWS  [R0603_5MIL_DWS]
R78  13k/1%  R-EU_R0603_5MIL_DWS  [R0603_5MIL_DWS]
R79  NA(100k)  R-EU_R0603_5MIL_DWS  [R0603_5MIL_DWS]
R80  13k/1%  R-EU_R0603_5MIL_DWS  [R0603_5MIL_DWS]
R81  2.2k/1%  R-EU_R0603_5MIL_DWS  [R0603_5MIL_DWS]
R82  2.2k/1%  R-EU_R0603_5MIL_DWS  [R0603_5MIL_DWS]
R83  2.2k/1%  R-EU_R0603_5MIL_DWS  [R0603_5MIL_DWS]
R84  47k  R-EU_R0603_5MIL_DWS  [R0603_5MIL_DWS]
R85  100k/1%  R-EU_R0603_5MIL_DWS  [R0603_5MIL_DWS]
R86  2.2k/1%  R-EU_R0603_5MIL_DWS  [R0603_5MIL_DWS]
R87  0R(Board_Mounted)  R_0R0R(NA)  [0603_0R]
R88  8.25k/1%  R-EU_R0603_5MIL_DWS  [R0603_5MIL_DWS]
R89  4.99k/1%  R-EU_R0603_5MIL_DWS  [R0603_5MIL_DWS]
R90  1.1k/1%  R-EU_R0603_5MIL_DWS  [R0603_5MIL_DWS]
R91  100k/1%  R-EU_R0603_5MIL_DWS  [R0603_5MIL_DWS]
R92  1.1k/1%  R-EU_R0603_5MIL_DWS  [R0603_5MIL_DWS]
R93  2.2k/1%  R-EU_R0603_5MIL_DWS  [R0603_5MIL_DWS]
R94  2.2k/1%  R-EU_R0603_5MIL_DWS  [R0603_5MIL_DWS]
R95  47k  R-EU_R0603_5MIL_DWS  [R0603_5MIL_DWS]
R96  6.81k/1%  R-EU_R0603_5MIL_DWS  [R0603_5MIL_DWS]
R97  8.25k/1%  R-EU_R0603_5MIL_DWS  [R0603_5MIL_DWS]
R98  10k  R-EU_R0603_5MIL_DWS  [R0603_5MIL_DWS]
R99  11k/1%  R-EU_R0603_5MIL_DWS  [R0603_5MIL_DWS]
R100  13k/1%  R-EU_R0603_5MIL_DWS  [R0603_5MIL_DWS]
R101  16.2k/1%  R-EU_R0603_5MIL_DWS  [R0603_5MIL_DWS]
R102  22.1k/1%  R-EU_R0603_5MIL_DWS  [R0603_5MIL_DWS]
R103  49.9R/1%  R-EU_R0603_5MIL_DWS  [R0603_5MIL_DWS]
R104  330R/1%  R-EU_R0603_5MIL_DWS  [R0603_5MIL_DWS]
R105  10k  R-EU_R0603_5MIL_DWS  [R0603_5MIL_DWS]
R106  NA(330R/1%)  R-EU_R0603_5MIL_DWS  [R0603_5MIL_DWS]
R107  NA(330R/1%)  R-EU_R0603_5MIL_DWS  [R0603_5MIL_DWS]
R108  100k/1%  R-EU_R0603_5MIL_DWS  [R0603_5MIL_DWS]
R109  NA(47k)  R-EU_R0603_5MIL_DWS  [R0603_5MIL_DWS]
R118  22R  R-EU_R0402_TI  [R0402_TI]
R119  22R  R-EU_R0402_TI  [R0402_TI]
R120  2.2k/1%  R-EU_R0603_5MIL_DWS  [R0603_5MIL_DWS]
R121  NA(10k)  R-EU_R0603_5MIL_DWS  [R0603_5MIL_DWS]
R122  NA(0R)  R-EU_R0402_TI  [R0402_TI]
R123  NA(0R)  R-EU_R0402_TI  [R0402_TI]
R124  NA(0R)  R-EU_R0402_TI  [R0402_TI]
R125  NA(0R)  R-EU_R0402_TI  [R0402_TI]
R126  NA(0R)  R-EU_R0402_TI  [R0402_TI]
R127  NA(0R)  R-EU_R0402_TI  [R0402_TI]
R128  NA(0R)  R-EU_R0402_TI  [R0402_TI]
R129  NA(0R)  R-EU_R0402_TI  [R0402_TI]
R130  NA(0R)  R-EU_R0402_TI  [R0402_TI]
R131  NA(0R)  R-EU_R0402_TI  [R0402_TI]
R132  NA(0R)  R-EU_R0402_TI  [R0402_TI]
R133  22R  R-EU_R0402_TI  [R0402_TI]
R134  22R  R-EU_R0402_TI  [R0402_TI]
R135  22R  R-EU_R0402_TI  [R0402_TI]
R136  10k  R-EU_R0603_5MIL_DWS  [R0603_5MIL_DWS]
R137  10k  R-EU_R0603_5MIL_DWS  [R0603_5MIL_DWS]
R138  4.99k/1%  R-EU_R0603_5MIL_DWS  [R0603_5MIL_DWS]
R139  10M  R-EU_R0402_TI  [R0402_TI]
R140  12.1k/1%  R-EU_R0603_5MIL_DWS  [R0603_5MIL_DWS]
R141  49.9R/1%  R-EU_R0603_5MIL_DWS  [R0603_5MIL_DWS]
R142  49.9R/1%  R-EU_R0603_5MIL_DWS  [R0603_5MIL_DWS]
R143  49.9R/1%  R-EU_R0603_5MIL_DWS  [R0603_5MIL_DWS]
R144  NA(10k)  R-EU_R0402_TI  [R0402_TI]
R145  NA(10k)  R-EU_R0402_TI  [R0402_TI]
R146  NA(22R)  R-EU_R0402_TI  [R0402_TI]
R147  NA(22R)  R-EU_R0402_TI  [R0402_TI]
R148  NA(22R)  R-EU_R0402_TI  [R0402_TI]
R149  49.9R/1%  R-EU_R0603_5MIL_DWS  [R0603_5MIL_DWS]
R150  330R/1%  R-EU_R0603_5MIL_DWS  [R0603_5MIL_DWS]
R151  330R/1%  R-EU_R0603_5MIL_DWS  [R0603_5MIL_DWS]
R152  10k  R-EU_R0603_5MIL_DWS  [R0603_5MIL_DWS]
RECOVERY  SIDE_WTCM-TR(3X4)  SW-TAKTSIDE_WTCM-TR(3X4)  [SW_TAKT3X4]
RESET  SIDE_WTCM-TR(3X4)  SW-TAKTSIDE_WTCM-TR(3X4)  [SW_TAKT3X4]
RM1  RA1206_(4X0603)_4B8_0R  R_MATRIX_4E  [R_MATRIX_4]
RM2  NA(RA1206_(4X0603)_4B8_0R)  R_MATRIX_4E  [R_MATRIX_4]
RM3  NA(RA1206_(4X0603)_4B8_10k)  R_MATRIX_4E  [R_MATRIX_4]
RM4  NA(RA0805_(4X0402)_22R)  R_MATRIX_4E_25X625  [R_MATRIX_4_0402_25X625]
RM5  NA(RA0805_(4X0402)_22R)  R_MATRIX_4E_25X625  [R_MATRIX_4_0402_25X625]
RM6  NA(RA1206_(4X0603)_4B8_10k)  R_MATRIX_4E  [R_MATRIX_4]
RM7  RA1206_(4X0603)_4B8_75R  R_MATRIX_4E  [R_MATRIX_4]
RM8  RA1206_(4X0603)_4B8_100K  R_MATRIX_4E  [R_MATRIX_4]
RM9  RA1206_(4X0603)_4B8_1.5k  R_MATRIX_4E  [R_MATRIX_4]
RM10  RA1206_(4X0603)_4B8_1.5k  R_MATRIX_4E  [R_MATRIX_4]
RM11  RA1206_(4X0603)_4B8_100K  R_MATRIX_4E  [R_MATRIX_4]
RM25  RA1206_(4X0603)_4B8_10k  R_MATRIX_4E  [R_MATRIX_4]
SATA  SATA-PWA-07  [SATA-PWA-07]
SD/MMC1  MICRO_SD/TFC-WPAPR-08  MICRO_SD/MMC_CP_NEWTFC-WPAPR-08  [TFC-WPAPR-08]
SD/MMC2  PSD006A-LT2-BA0  SD_CARD_PSD006A-LT2-BA0  [SD_CARD]
SEARCH  SIDE_WTCM-TR(3X4)  SW-TAKTSIDE_WTCM-TR(3X4)  [SW_TAKT3X4]
T1  BC846B(SOT23-3)  NPN-TRANSISTOR_SOT23  [SOT23]
U1  A20(TFBGA441)  A10  [TFBGA441]
U2  MT41K256M16HA-125:E(DDR3L-1600_11-11-11)  H5TQ2G63BFR_MEM4G16D3EABG-125PHIS  [FBGA96_MEM]
U3  MT41K256M16HA-125:E(DDR3L-1600_11-11-11)  H5TQ2G63BFR_MEM4G16D3EABG-125PHIS  [FBGA96_MEM]
U4  FIDUCIAL  [FIDUCIAL-1X3]
U5  FIDUCIAL  [FIDUCIAL-1X3]
U6  AT24C16BN-SH(SOIC-8)  24LCXX  [SO-08MN]
U7  LAN8710A-EZC-TR(QFN-32)  LAN8710A-EZC  [QFN-32(DRILLS)]
U8  NA(H27UBG8T2BTR_or_MT29F64G08CBABAWP:BTR(8GB_NAND))  H27UBG8T2A  [TSOP48]
U9  SY6280AAC(SOT23-5)  SY6280  [SOT23-5]
U10  SY6280AAC(SOT23-5)  SY6280  [SOT23-5]
U11  SY6280AAC(SOT23-5)  SY6280  [SOT23-5]
U12  AXP209(QFN48)  AXP209  [QFN48]
U13  SY8009AAAC(SOT23-5)  SY8008  [SOT23-5]
U14  MP1584EN(SOIC8E)  [SOIC8E]
U15  SY8009AAAC(SOT23-5)  SY8008  [SOT23-5]
U16  SY7208(SOT23-6)  SY7208  [SOT23-6]
U17  NA(RCLAMP0524P)  RCLAMP0524P  [SLP2510P8]
U18  FIDUCIAL  [FIDUCIAL-1X3]
U19  FIDUCIAL  [FIDUCIAL-1X3]
U20  FIDUCIAL  [FIDUCIAL-1X3]
U21  FIDUCIAL  [FIDUCIAL-1X3]
U22  NA(RCLAMP0524P)  RCLAMP0524P  [SLP2510P8]
U23  NA(RCLAMP0524P)  RCLAMP0524P  [SLP2510P8]
U24  NA(MTFC4GACAANA-4M_IT(TBGA100))  MTFC4GACAANA-4MIT  [TBGA100]
UART0  HN1X4  CON4HN1X4  [HN1X4]
UEXT1  GBH-254-SMT-10  ML10MD  [ML10_S]
UEXT2  GBH-254-SMT-10  ML10MD  [ML10_S]
USB_HOST  USB_TWO_LEVEL  [USB_TWO_LEVEL]
USB_OTG  USB-OTG  MINI_USB9  [USB_MINI_9PIN]
VGA  WU06S  CON6  [CON1.27MM-6-SMALL_ICSP]
VOL+  SIDE_WTCM-TR(3X4)  SW-TAKTSIDE_WTCM-TR(3X4)  [SW_TAKT3X4]
VOL-  SIDE_WTCM-TR(3X4)  SW-TAKTSIDE_WTCM-TR(3X4)  [SW_TAKT3X4]
VPS+  Open  SJSJ_SMALLER  [SJ_1_SMALLER]
VPS-  Open  SJSJ_SMALLER  [SJ_1_SMALLER]
VR1  AP1231-2.5V(SOT23-5)  AP1231-33  [SOT-23-5]